# Altium schematic sheet Perifericos.SchDoc: Perifericos
size A4; Author: Agustin Zuliani; Revision: Rev: 00; SheetNumber: 4; SheetTotal: 7
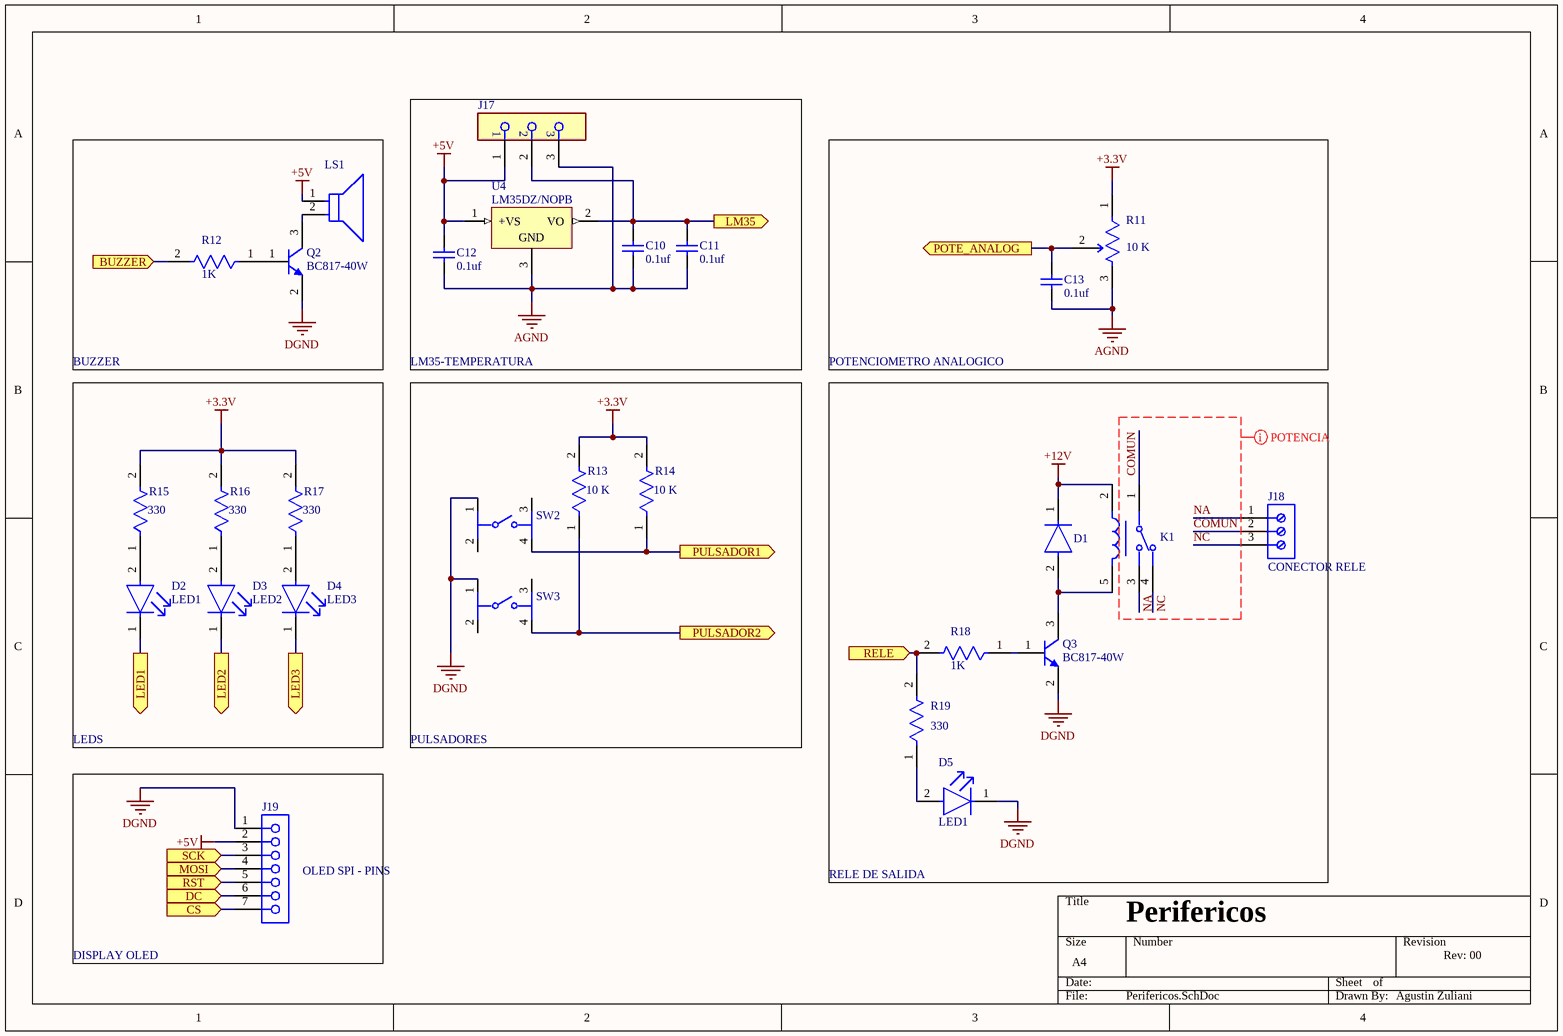
[diagram p0: Perifericos.SchDoc]

## Parts
C10  0.1uf  [CAPC2013X145X50NL20T25]
C11  0.1uf  [CAPC2013X145X50NL20T25]
C12  0.1uf  [CAPC2013X145X50NL20T25]
C13  0.1uf  [CAPC2013X145X50NL20T25]
D1  1N4007 SMD  [FP-1N4007_SMD-IPC_C]  (value not drawn)
D2  LED1  [FP-SML-LX0805UWC-TR-MFG]
D3  LED2  [FP-SML-LX0805UWC-TR-MFG]
D4  LED3  [FP-SML-LX0805UWC-TR-MFG]
D5  LED1  [FP-SML-LX0805UWC-TR-MFG]
J17  SSQ-103-01-T-S  [FP-SSQ-103-01-T-S-MFG]  (value not drawn)
J18  CONECTOR RELE  [691216710003]
J19  OLED SPI - PINS  [61300711821]
K1  G5LE-1-E DC5  [FP-G5LE-1-E_DC5-MFG]  (value not drawn)
LS1  AT-1224-TWT-5V-2-R  [FP-AT-1224-TWT-5V-2-R-MFG]  (value not drawn)
Q2  BC817-40W  [DIOD-SOT323-3_V]
Q3  BC817-40W  [DIOD-SOT323-3_V]
R11  10 K  [FP-COM-09806-MFG]
R12  1K  [FP-RN73R2A-IPC_A]
R13  10 K  [FP-RN73R2A-IPC_A]
R14  10 K  [FP-RN73R2A-IPC_A]
R15  330  [FP-RN73R2A-IPC_A]
R16  330  [FP-RN73R2A-IPC_A]
R17  330  [FP-RN73R2A-IPC_A]
R18  1K  [FP-RN73R2A-IPC_A]
R19  330  [FP-RN73R2A-IPC_A]
SW2  1-1825910-4  [FP-1-1825910-4-MFG]  (value not drawn)
SW3  1-1825910-4  [FP-1-1825910-4-MFG]  (value not drawn)
U4  LM35DZ/NOPB  [LP0003A]

## Blocks framed on the sheet
LM35-TEMPERATURA: C10-C12 J17 U4
BUZZER: LS1 Q2 R12
POTENCIOMETRO ANALOGICO: C13 R11
LEDS: D2-D4 R15-R17
PULSADORES: R13 R14 SW2 SW3
RELE DE SALIDA: D1 D5 J18 K1 Q3 R18 R19
DISPLAY OLED: J19

## Ports
BUZZER (in), CS (in), DC (in), LED1 (out), LED2 (out), LED3 (out), LM35 (out), MOSI (in), POTE_ANALOG (out), PULSADOR1 (out), PULSADOR2 (out), RELE (in), RST (in), SCK (in)

## Nets
+3.3V: R11.1(CW) R13.2 R14.2 R15.2 R16.2 R17.2
+5V: C12.2 J17.1 J19.2 LS1.1(C) U4.1(+VS)
+12V: D1.1(C) K1.2
AGND: C10.1 C11.1 C12.1 C13.1 J17.3 R11.3(CCW) U4.3(GND)
DGND: D5.1(C) J19.1 Q2.2(E) Q3.2(E) SW2.1 SW3.1
BUZZER: R12.2 ; port BUZZER
COMUN: J18.2 K1.1
CS: J19.7 ; port CS
DC: J19.6 ; port DC
LED1: D2.1(C) ; port LED1
LED2: D3.1(C) ; port LED2
LED3: D4.1(C) ; port LED3
LM35: C10.2 C11.2 J17.2 U4.2(VO) ; port LM35
MOSI: J19.4 ; port MOSI
NA: J18.1 K1.3
NC: J18.3 K1.4
POTE_ANALOG: C13.2 R11.2(WIPER) ; port POTE_ANALOG
PULSADOR1: R14.1 SW2.4 ; port PULSADOR1
PULSADOR2: R13.1 SW3.4 ; port PULSADOR2
RELE: R18.2 R19.2 ; port RELE
RST: J19.5 ; port RST
SCK: J19.3 ; port SCK
NetD1_2: D1.2(A) K1.5 Q3.3(C)
NetD2_2: D2.2(A) R15.1
NetD3_2: D3.2(A) R16.1
NetD4_2: D4.2(A) R17.1
NetD5_2: D5.2(A) R19.1
NetLS1_2: LS1.2(A) Q2.3(C)
NetQ2_1: Q2.1(B) R12.1
NetQ3_1: Q3.1(B) R18.1

Not connected (* = marked no-connect by the designer): SW2 2 3; SW3 2 3

## Layout directives
rule Clearance Constraint [Clearance = 2.5mm]: COMUN, NA, NC

## Library data of the parts
C10-C13 = CMP-2007-01227-1: CAP 100nf 20% 0805; Manufacturer: Kemet; Part Number: C0805S104K5RACTU
D1 = CMP-12389-000001-1: DIODE 1N4148 RELE PROTECTION
D2-D4 = CMP-00229-00139794-1: LED SMD 0805; NexarPartId: 139794; Approvals: CSA, UL; Lens Color: Clear, Yellow; Luminous Intensity: 150mcd; Power Rating: 120mW; Forward Current: 20mA; Forward Voltage: 3.5V; Illumination Color: White; Number of LEDs: 1; Viewing Angle: 120°; RoHS: Compliant; Case/Package: 0805; Min Operating Temperature: -40°C; Mount: Surface Mount; Max Operating Temperature: 85°C
D5 = CMP-00229-00139794-1: LED SMD 0805 / Rele status; NexarPartId: 139794; Approvals: CSA, UL; Lens Color: Clear, Yellow; Luminous Intensity: 150mcd; Power Rating: 120mW; Forward Current: 20mA; Forward Voltage: 3.5V; Illumination Color: White; Number of LEDs: 1; Viewing Angle: 120°; RoHS: Compliant; Case/Package: 0805; Min Operating Temperature: -40°C; Mount: Surface Mount; Max Operating Temperature: 85°C
J17 = CMP-02766-001396-1: HEADER PINS 3 POS / LM35 Pins; Pitch: 2.54mm; Connector Type: Receptacle; Max Current Rating: 7.6A; Max Voltage Rating (AC): 550V; Gender: Female; Number of Positions: 3; Contact Resistance: 10mR; Length: 8.13mm; Color: Black; Packaging: Bulk; Height: 8.51mm; RoHS Compliant: Yes; Min Operating Temperature: -55°C; Contact Type: Female Socket; Number of Rows: 1; Series: SSQ; Housing Color: Black; Lead Free: Lead Free; Mount: Through Hole; Housing Material: Plastic; Contact Material: Bronze; Contact Plating: Tin; Orientation: Straight; Termination: Solder; Max Operating Temperature: 105°C; Width: 2.41mm; Radiation Hardening: No; Number of Contacts: 3
J18 = CMP-1502-02533-3: TERMINAL BLOCK 3 POS / Salida Rele; Number of Contacts: 3; Voltage Rating: 300V; Current Rating: 24A; RoHS: Compliant; Height: 13.9mm; Contact Material: Nickel, Tin; Max Operating Temperature: 120°C; Number of Rows: 1; Min Operating Temperature: -30°C
J19 = CMP-1502-01326-4: HEADER PINS 7 POS / Pins Display OLED; Gender: Female; Operating Supply Voltage: 250V; Current Rating: 3A; Contact Resistance: 20mΩ; Lead Pitch: 2.54mm; RoHS: Non-Compliant; Orientation: Vertical; Number of Pins: 7
K1 = CMP-08822-000286-1: RELAY; Power Consumption: 400mW; Throw Configuration: SPDT; Coil Resistance: 63R; Coil Type: Non-Latching; Release Time: 5ms; Max Voltage Rating (AC): 250V; Relay Type: General Purpose; Coil Voltage (DC): 5V; Max Current Rating: 16A; Life (Hours): 1000000Hour; Coil Current: 79.4mA; Operate Time: 10ms; Packaging: Rail/Tube; Lead Free: Lead Free; Termination: Solder; Height: 19mm; Series: G5LE; RoHS Compliant: Yes; Min Operating Temperature: -25°C; Package Quantity: 100; Width: 16.5mm; Contact Material: Tin; Length: 22.5mm; Coil Power: 400mW; Depth: 16.5mm; Radiation Hardening: No; Contact Current Rating: 16A; Weight: 12g; Max Operating Temperature: 85°C; Number of Pins: 5; Mount: PCB
LS1 = CMP-231722-000001-1: BUZZER MAGNETIC 5V 12MM TH; Operating Supply Current: 40mA; Frequency: 2.4kHz; Min Operating Temperature: -30°C; Voltage Rating: 5V; Mount: Through Hole; Diameter: 12mm; Termination: PC Pins; Max Operating Temperature: 70°C; Contact Plating: Tin; Height: 9mm; Series: AT; Max Supply Current: 40mA; Sensing Method: Magnetic; Packaging: Tray
Q2 = CMP-2000-05934-1: BJT NPN BC817 / Buzzer; Manufacturer: DiodesIncorporated; Configuration: Single; Collector- Emitter Voltage VCEO Max: 45V; Emitter- Base Voltage VEBO: 5V; DC Collector/Base Gain hfe Min: 250; Collector-Emitter Saturation Voltage: 0.7V; Collector- Base Voltage VCBO: 50V; Maximum DC Collector Current: 1A; Pd - Power Dissipation: 200mW; Gain Bandwidth Product fT: 100MHz; Unit Weight: 0.000282oz; Series: BC817; Datasheet Version: Rev. 5-2, 01/2014; Datasheet URL: http://www.diodes.com/_files/datasheets/ds30575.pdf; Manufacturer URL: http://www.diodes.com/; Length: 2.2mm; Mounting Style: SMD/SMT; Maximum Operating Temperature: +150C; Package Description: 3-Pin Small Outline Transistor, Body 2 x 1.25 mm, Pitch 0.65 mm; Width: 1.35mm; RoHS: True; Minimum Operating Temperature: -65C; Brand: DiodesIncorporated; Product Category: BipolarTransistors-BJT; Height: 1mm; Factory Pack Quantity: 3000; Package / Case: SOT-23; Packaging: Reel; Transistor Polarity: NPN; Mounting Technology: SurfaceMount; Package Reference: SOT323
Q3 = CMP-2000-05934-1: BJT NPN BC817 SOT323 / Rele; Manufacturer: DiodesIncorporated; Configuration: Single; Collector- Emitter Voltage VCEO Max: 45V; Emitter- Base Voltage VEBO: 5V; DC Collector/Base Gain hfe Min: 250; Collector-Emitter Saturation Voltage: 0.7V; Collector- Base Voltage VCBO: 50V; Maximum DC Collector Current: 1A; Pd - Power Dissipation: 200mW; Gain Bandwidth Product fT: 100MHz; Unit Weight: 0.000282oz; Series: BC817; Datasheet Version: Rev. 5-2, 01/2014; Datasheet URL: http://www.diodes.com/_files/datasheets/ds30575.pdf; Manufacturer URL: http://www.diodes.com/; Length: 2.2mm; Mounting Style: SMD/SMT; Maximum Operating Temperature: +150C; Package Description: 3-Pin Small Outline Transistor, Body 2 x 1.25 mm, Pitch 0.65 mm; Width: 1.35mm; RoHS: True; Minimum Operating Temperature: -65C; Brand: DiodesIncorporated; Product Category: BipolarTransistors-BJT; Height: 1mm; Factory Pack Quantity: 3000; Package / Case: SOT-23; Packaging: Reel; Transistor Polarity: NPN; Mounting Technology: SurfaceMount; Package Reference: SOT323
R11 = CMP-02417-76381460-1: RES TRIMMER 10K 5% THT; Temperature Coefficient: 100ppm/°C; Tolerance: 10%; Power Rating: 500mW; Resistance: 10kΩ; Max Operating Temperature: 125°C; Composition: Cermet; Height: 10.92mm; Min Operating Temperature: -55°C; NexarPartId: 76381460
R12 = CMP-04015-052084-1: RES 1K 5% 0805 / Buzzer
R13 R14 = CMP-04015-052084-1: RES 10K 5% 0805
R15-R17 = CMP-04015-052084-1: RES 330R 5% 0805
R18 = CMP-04015-052084-1: RES 1K 5% 0805 / Rele
R19 = CMP-04015-052084-1: RES 330R 5% 0805 / Rele
SW2 = CMP-03407-000002-1: SWITCH TACTILE 6mm / Pulsador 1; Manufacturer: TE Connectivity; Throw Configuration: SPST-NO; Operating Force: 160gf; Contact Current Rating: 50mA; Voltage Rating Dc: 24V; Electromechanical Life: 100000Cycles; Contact Resistance: 100mΩ; Octopart: https://octopart.com/1-1825910-4-te+connectivity-42270468; ComponentLink2URL: https://www.te.com/commerce/DocumentDelivery/DDEController?Action=showdoc&DocId=Customer+Drawing%7F1825910%7FC10%7Fpdf%7FEnglish%7FENG_CD_1825910_C10.pdf%7F1-1825910-4; Height: 9.8mm; Package: 1-1825910-4; Automotive: No; Device Class L2: Switches; Temperature Range High: +85°C; Device Class L3: Tactile Switches; Mouser Description: Tactile Switches 6MM ACTHIGH TEMP TACT SWITCH; Manufacturer Part Number: 1-1825910-4; Lead Free: Yes; Temperature Range Low: -35°C; Digikey Description: SWITCH TACTILE SPST-NO 0.05A 24V; Device Class L1: Electromechanical; Mount: Through Hole; RoHS: TRUE; ComponentLink2Description: Datasheet; Temperature: -35°C to +85°C; Category: Switch
SW3 = CMP-03407-000002-1: SWITCH TACTILE 6mm / Pulsador 2; Manufacturer: TE Connectivity; Throw Configuration: SPST-NO; Operating Force: 160gf; Contact Current Rating: 50mA; Voltage Rating Dc: 24V; Electromechanical Life: 100000Cycles; Contact Resistance: 100mΩ; Octopart: https://octopart.com/1-1825910-4-te+connectivity-42270468; ComponentLink2URL: https://www.te.com/commerce/DocumentDelivery/DDEController?Action=showdoc&DocId=Customer+Drawing%7F1825910%7FC10%7Fpdf%7FEnglish%7FENG_CD_1825910_C10.pdf%7F1-1825910-4; Height: 9.8mm; Package: 1-1825910-4; Automotive: No; Device Class L2: Switches; Temperature Range High: +85°C; Device Class L3: Tactile Switches; Mouser Description: Tactile Switches 6MM ACTHIGH TEMP TACT SWITCH; Manufacturer Part Number: 1-1825910-4; Lead Free: Yes; Temperature Range Low: -35°C; Digikey Description: SWITCH TACTILE SPST-NO 0.05A 24V; Device Class L1: Electromechanical; Mount: Through Hole; RoHS: TRUE; ComponentLink2Description: Datasheet; Temperature: -35°C to +85°C; Category: Switch
U4 = CMP-0066-00030-3: CI LM35 TO92; Manufacturer: Texas Instruments; PowerWise: N; PackageTopMarking: NSXYTT*LM35*DZ; CompType: Temp Sensor IC; RoHS: Y; PackageReference: LP0003A; PinCount: 3; ComponentLink1URL: http://www.ti.com/general/docs/lit/getliterature.tsp?genericPartNumber=LM35&fileType=pdf; Code_JEDEC: TO-226-AA; PackageDescription: TO-92, Molded, 3 Lead; ComponentLink1Description: Datasheet URL